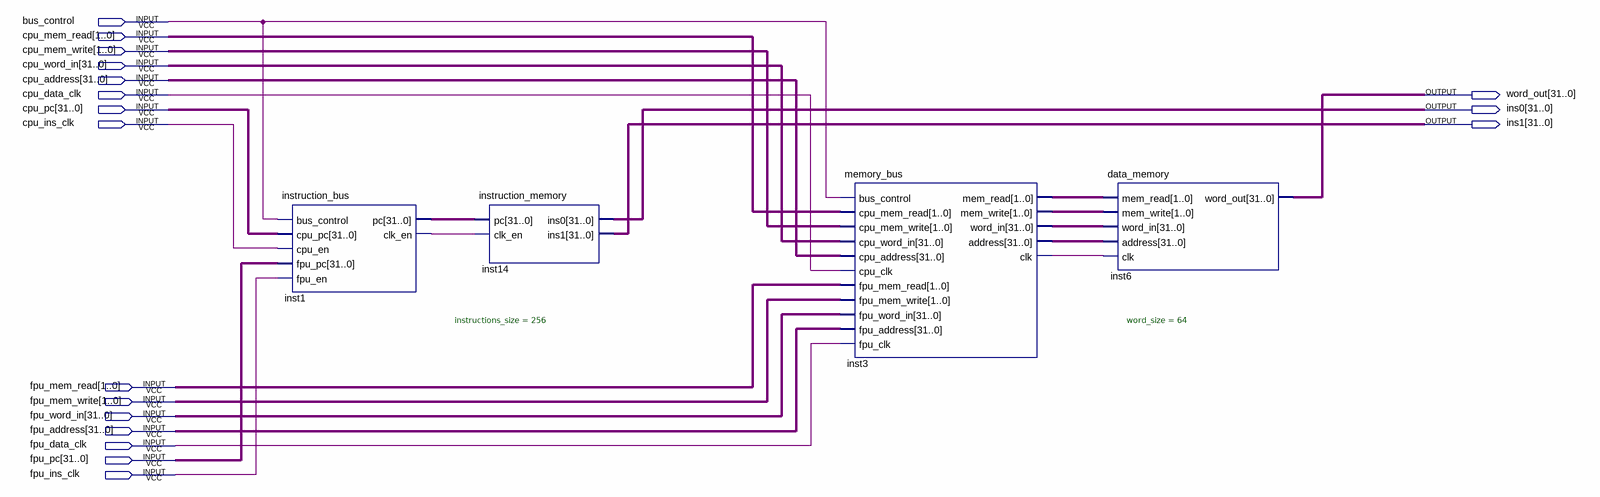
[diagram p0: schematic sheet]
// Quartus schematic memory.bdf as structural Verilog: 4 symbols, 18 pins
module memory (
  input  bus_control,
  input  [1:0] cpu_mem_read,
  input  [1:0] cpu_mem_write,
  input  [31:0] cpu_word_in,
  input  [31:0] cpu_address,
  input  cpu_data_clk,
  input  [31:0] cpu_pc,
  input  cpu_ins_clk,
  input  [1:0] fpu_mem_read,
  input  [1:0] fpu_mem_write,
  input  [31:0] fpu_word_in,
  input  [31:0] fpu_address,
  input  fpu_data_clk,
  input  [31:0] fpu_pc,
  input  fpu_ins_clk,
  output [31:0] word_out,
  output [31:0] ins0,
  output [31:0] ins1
);

  wire inst1_clk_en, inst3_clk;
  wire [1:0] inst3_mem_read, inst3_mem_write;
  wire [31:0] inst1_pc, inst3_address, inst3_word_in;

  instruction_bus inst1 (
    .bus_control(bus_control), .cpu_pc(cpu_pc), .cpu_en(cpu_ins_clk), .fpu_pc(fpu_pc), .fpu_en(fpu_ins_clk),
    .pc(inst1_pc), .clk_en(inst1_clk_en));
  instruction_memory #(.instructions_size(256)) inst14 (.pc(inst1_pc), .clk_en(inst1_clk_en), .ins0(ins0), .ins1(ins1));
  memory_bus inst3 (
    .bus_control(bus_control), .cpu_mem_read(cpu_mem_read), .cpu_mem_write(cpu_mem_write),
    .cpu_word_in(cpu_word_in), .cpu_address(cpu_address), .cpu_clk(cpu_data_clk),
    .fpu_mem_read(fpu_mem_read), .fpu_mem_write(fpu_mem_write), .fpu_word_in(fpu_word_in),
    .fpu_address(fpu_address), .fpu_clk(fpu_data_clk), .mem_read(inst3_mem_read),
    .mem_write(inst3_mem_write), .word_in(inst3_word_in), .address(inst3_address), .clk(inst3_clk));
  data_memory #(.word_size(64)) inst6 (
    .mem_read(inst3_mem_read), .mem_write(inst3_mem_write), .word_in(inst3_word_in), .address(inst3_address),
    .clk(inst3_clk), .word_out(word_out));
endmodule
